# Altium schematic sheet Motor_3.SchDoc
size A4
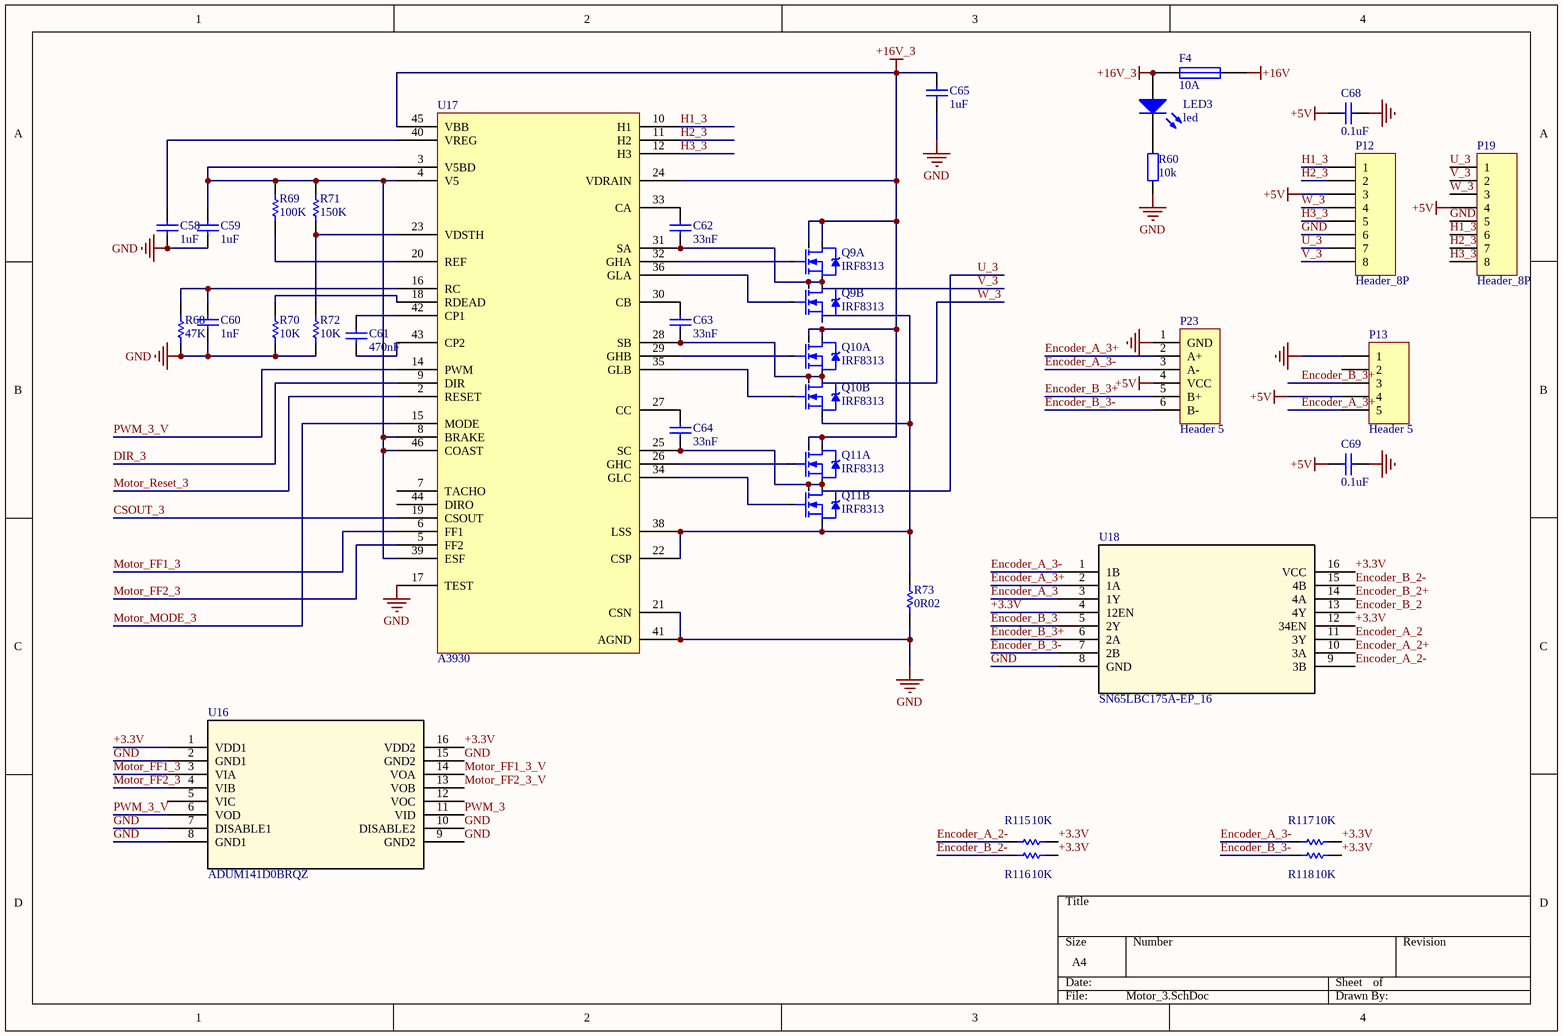
[diagram p0: Motor_3.SchDoc]

## Parts
C58  1uf  [0603C]
C59  1uf  [0603C]
C60  1nf  [0603C]
C61  470nf  [0603C]
C62  33nf  [0603C]
C63  33nf  [0603C]
C64  33nf  [0603C]
C65  1uf  [0603C]
C68  0.1uf  [0603C]
C69  0.1uf  [0603C]
F4  10A  [FUSE_HEADER]
LED3  led  [0603_diode]
P12  Header_8P  [8P - WF25122]
P13  Header 5  [SHDR5]
P19  Header_8P  [SHDR8]
P23  Header 5  [SHDR6]
Q9  IRF8313  [so-8 bg]  (parts A,B of 2)
Q10  IRF8313  [so-8 bg]  (parts A,B of 2)
Q11  IRF8313  [so-8 bg]  (parts A,B of 2)
R60  10k  [0603]
R68  47k  [0603R]
R69  100k  [0603R]
R70  10k  [0603R]
R71  value 150K  [0603R]  (hidden comment: 100k)
R72  10k  [0603R]
R73  value 0R02  [1206 10A]  (hidden comment: 0.02)
R115  10k  [0603R]
R116  10k  [0603R]
R117  10k  [0603R]
R118  10k  [0603R]
U16  ADUM141D0BRQZ  [RQ_16]
U17  A3930  [LQFP-48]
U18  SN65LBC175A-EP_16  [SOP16]

## Nets
+5V: C68.2 C69.2 P12.3 P13.4 P19.4 P23.4(VCC)
+16V: F4.1
+16V_3: C65.2 F4.2 LED3.1(A) Q9.7(D2) Q9.8(D2) Q10.7(D2) Q10.8(D2) Q11.7(D2) Q11.8(D2) U17.24(VDRAIN) U17.45(VBB)
GND: C58.1 C59.1 C60.1 C65.1 C68.1 C69.1 P12.6 P13.1 P19.5 P23.1(GND) R60.1 R68.1 R70.1 R72.1 R73.1 U16.2(GND1) U16.7(DISABLE1) U16.8(GND1) U16.9(GND2) U16.10(DISABLE2) U16.15(GND2) U17.17(TEST) U17.21(CSN) U17.41(AGND) U18.8(GND)
+3.3V: R115.1 R116.1 R117.1 R118.1 U16.1(VDD1) U16.16(VDD2) U18.4(12EN) U18.12(34EN) U18.16(VCC)
CSOUT_3: U17.19(CSOUT)
DIR_3: U17.9(DIR)
Encoder_A_2: U18.11(3Y)
Encoder_A_2+: U18.10(3A)
Encoder_A_2-: R115.2 U18.9(3B)
Encoder_A_3: U18.3(1Y)
Encoder_A_3+: P13.5 P23.2(A+) U18.2(1A)
Encoder_A_3-: P23.3(A-) R117.2 U18.1(1B)
Encoder_B_2: U18.13(4Y)
Encoder_B_2+: U18.14(4A)
Encoder_B_2-: R116.2 U18.15(4B)
Encoder_B_3: U18.5(2Y)
Encoder_B_3+: P13.3 P23.5(B+) U18.6(2A)
Encoder_B_3-: P23.6(B-) R118.2 U18.7(2B)
H1_3: P12.1 P19.6 U17.10(H1)
H2_3: P12.2 P19.7 U17.11(H2)
H3_3: P12.5 P19.8 U17.12(H3)
Motor_FF1_3: U16.3(VIA) U17.6(FF1)
Motor_FF1_3_V: U16.14(VOA)
Motor_FF2_3: U16.4(VIB) U17.5(FF2)
Motor_FF2_3_V: U16.13(VOB)
Motor_MODE_3: U17.15(MODE)
Motor_Reset_3: U17.2(RESET)
PWM_3: U16.11(VID)
PWM_3_V: U16.6(VOD) U17.14(PWM)
U_3: C64.1 P12.7 P19.1 Q11.1(S2) Q11.5(D1) Q11.6(D1) U17.25(SC)
V_3: C62.1 P12.8 P19.2 Q9.1(S2) Q9.5(D1) Q9.6(D1) U17.31(SA)
W_3: C63.1 P12.4 P19.3 Q10.1(S2) Q10.5(D1) Q10.6(D1) U17.28(SB)
NetC58_2: C58.2 U17.40(VREG)
NetC59_2: C59.2 R69.2 R71.2 U17.3(V5BD) U17.4(V5) U17.8(BRAKE) U17.39(ESF) U17.46(COAST)
NetC60_2: C60.2 R68.2 U17.16(RC)
NetC61_1: C61.1 U17.43(CP2)
NetC61_2: C61.2 U17.42(CP1)
NetC62_2: C62.2 U17.33(CA)
NetC63_2: C63.2 U17.30(CB)
NetC64_2: C64.2 U17.27(CC)
NetLED3_2: LED3.2(K) R60.2
NetQ9_2: Q9.2(G2) U17.32(GHA)
NetQ9_3: Q9.3(S1) Q10.3(S1) Q11.3(S1) R73.2 U17.22(CSP) U17.38(LSS)
NetQ9_4: Q9.4(G1) U17.36(GLA)
NetQ10_2: Q10.2(G2) U17.29(GHB)
NetQ10_4: Q10.4(G1) U17.35(GLB)
NetQ11_2: Q11.2(G2) U17.26(GHC)
NetQ11_4: Q11.4(G1) U17.34(GLC)
NetR69_1: R69.1 U17.20(REF)
NetR70_2: R70.2 U17.18(RDEAD)
NetR71_1: R71.1 R72.2 U17.23(VDSTH)

Not connected (* = marked no-connect by the designer): P13 2; U16 5(VIC) 12(VOC); U17 7(TACHO) 44(DIRO)

## Library data of the parts
C58-C65 C68 C69 = Cap: Capacitor; Manufacturer: Generic Components; Class: Passive; Published: 08/06/2000; Publisher: Altium Hobart Technology Centre; SubClass: Capacitor
  C58 C59 C65: Value: 1uF
  C60: Value: 1nF
  C61: Value: 470nF
  C62-C64: Value: 33nF
  C68 C69: Value: 0.1uF
F4 = FUSE
P12 P19 = Header_8P: Used for Motor connection in ZJUNlict
P13 = Header 5: Header, 5-Pin; LatestRevisionDate: 17-Jul-2002; LatestRevisionNote: Re-released for DXP Platform.; Publisher: Altium Limited
P23 = Header 6: Header, 5-Pin; LatestRevisionDate: 17-Jul-2002; LatestRevisionNote: Re-released for DXP Platform.; Publisher: Altium Limited
Q9-Q11 = SO-8 IRF8313
R60 = res
R68-R73 R115-R118 = Res1: Resistor; Manufacturer: Generic Components; Class: Passive; Published: 08/06/2000; Publisher: Altium Hobart Technology Centre; SubClass: Resistor
  R68: Value: 47K
  R69: Value: 100K
  R70 R72 R115-R118: Value: 10K
U16 = ADUM141D0BRQZ: Imported; RefDes: RefDes; Type: DEV; Value: Value
U17 = LQFP 48
U18 = SN65LBC175A-EP_16: Quadruple 2-Input Positive-NAND Gates; Manufacturer: Texas Instruments; GENERIC_PART_NUMBER: 74AC11000; INDUSTRY_STD_PKG_TYPE: SOIC; PIN_COUNT: 16; PACKAGE_DESIGNATOR: D; Datasheet_URL: http://www.ti.com/lit/gpn/74AC11000; FAMILY_NAME: NAND GATE; RefDes: RefDes; Type: DEV; Value: Value